# Altium schematic sheet Clock_distrubution.SchDoc: FPGA Motherboard for Digital Multiplexed Readout, McGill U.
size A; DocumentNumber: DfMUX14; Revision: Rev0, Prototype; SheetNumber: 14; SheetTotal: 27; PageSetup: Record=PageOptions|CenterHorizontal=True|CenterVertical=True|PrintScale=1.05|XCorrection=1.00|YCorrection=1.00|PrintKind=0|BorderSize=5000000|LeftOffset=0|BottomOffset=0|Orientation=2|PaperLength=1000|PaperWidth=1000|Scale=100|PaperSource=7|PrintQuality=-4|MediaType=1|DitherType=10|PaperKind=Letter|PrintScaleMode=1
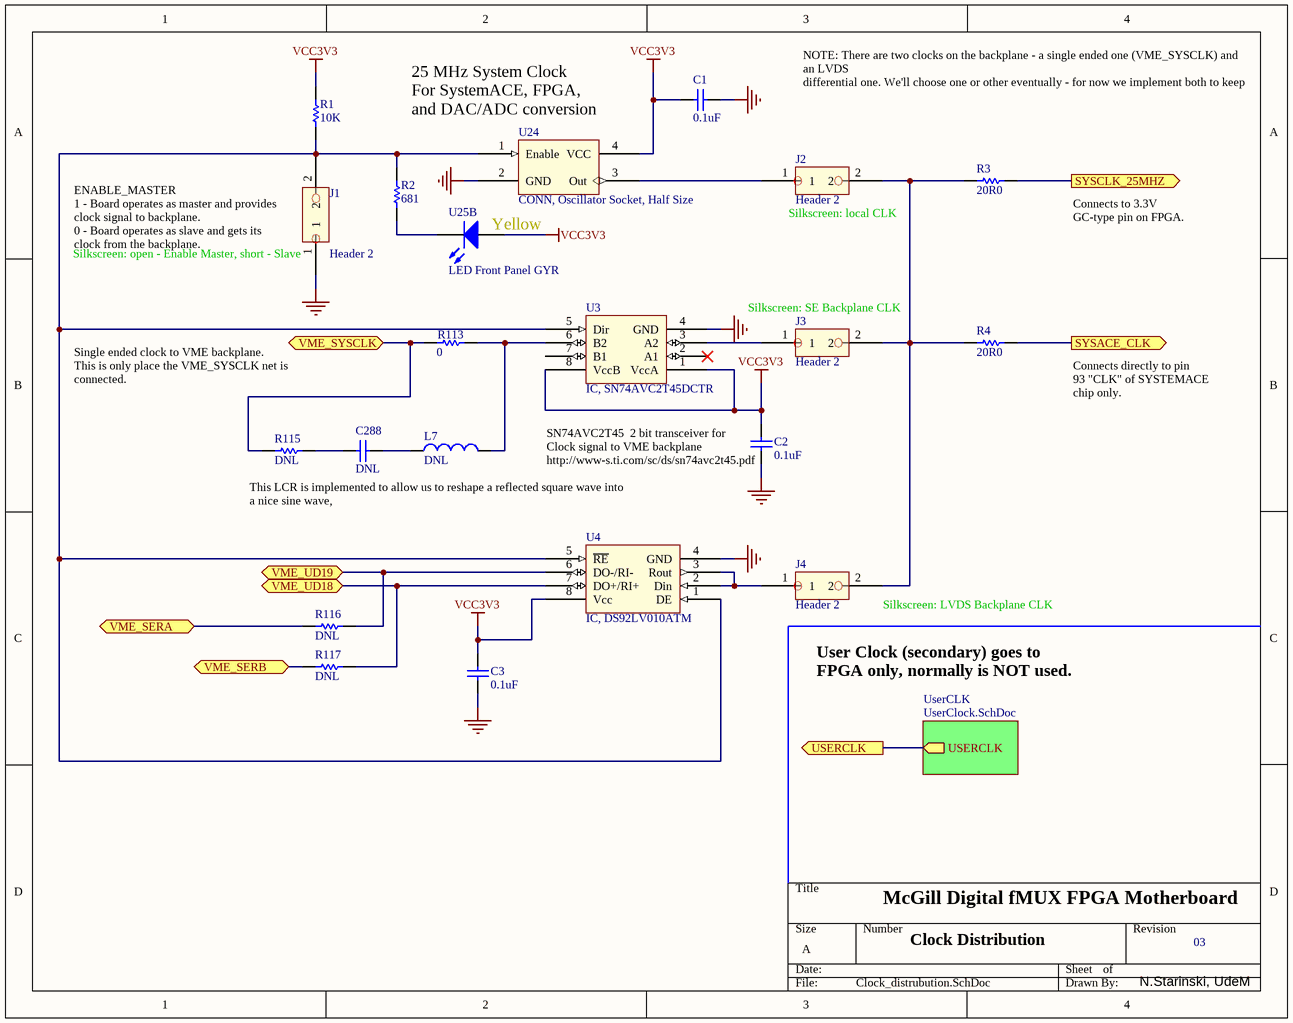
[diagram p0: Clock_distrubution.SchDoc]

## Parts
C1  0.1uF  [CC1608-0603]
C2  0.1uF  [CC1608-0603]
C3  0.1uF  [CC1608-0603]
C288  DNL  [CC1608-0603]
J1  Header 2  [HDR1X2]
J2  Header 2  [HDR1X2]
J3  Header 2  [HDR1X2]
J4  Header 2  [HDR1X2]
L7  DNL  [INDC2012-0805]
R1  10K  [CR1608-0603]
R2  681  [CR1608-0603]
R3  20R0  [CR1608-0603]
R4  20R0  [CR1608-0603]
R113  0  [CR1608-0603]
R115  DNL  [CR1608-0603]
R116  DNL  [CR1608-0603]
R117  DNL  [CR1608-0603]
U3  IC, SN74AVC2T45DCTR  [TSSO3x5-G8/X.35]
U4  IC, DS92LV010ATM  [SOP8]
U24  CONN, Oscillator Socket, Half Size  [DIP_Osc]
U25  LED Front Panel GYR  [LED_Tri_]  (part B of 3)

## Sub-sheets
UserCLK = UserClock.SchDoc: USERCLK (out)

## Ports
SYSACE_CLK (out), SYSCLK_25MHZ (out), USERCLK (out), VME_SERA (bidir), VME_SERB (bidir), VME_SYSCLK (bidir), VME_UD18 (bidir), VME_UD19 (bidir)

## Nets
GND: C1.2 C2.1 C3.1 J1.1 U3.4(GND) U4.4(GND) U24.2(GND)
VCC3V3: C1.1 C2.2 C3.2 R1.2 U3.1(VccA) U3.8(VccB) U4.8(Vcc) U24.4(VCC) U25.A2(A)
SYSACE_CLK: R4.2 ; port SYSACE_CLK
SYSCLK_25MHZ: R3.2 ; port SYSCLK_25MHZ
USERCLK: port USERCLK, sheet UserCLK/USERCLK
VME_SERA: R116.1 ; port VME_SERA
VME_SERB: R117.1 ; port VME_SERB
VME_SYSCLK: R113.1 R115.1 ; port VME_SYSCLK
VME_UD18: R117.2 U4.7(DO+/RI+) ; port VME_UD18
VME_UD19: R116.2 U4.6(DO-/RI-) ; port VME_UD19
NetC288_1: C288.1 R115.2
NetC288_2: C288.2 L7.1
NetJ1_2: J1.2 R1.1 R2.2 U3.5(Dir) U4.1(DE) U4.5(~{RE}) U24.1(Enable)
NetJ2_1: J2.1 U24.3(Out)
NetJ2_2: J2.2 J3.2 J4.2 R3.1 R4.1
NetJ3_1: J3.1 U3.3(A2)
NetJ4_1: J4.1 U4.2(Din) U4.3(Rout)
NetL7_2: L7.2 R113.2 U3.6(B2)
NetR2_1: R2.1 U25.K2(K)

Not connected (* = marked no-connect by the designer): U3 2(A1)* 7(B1)

## Notes on the sheet
- NOTE: There are two clocks on the backplane - a single ended one (VME_SYSCLK) and an LVDS
  differential one. We'll choose one or other eventually - for now we implement both to keep our options open.
- (near U24) 25 MHz System Clock
  For SystemACE, FPGA,
  and DAC/ADC conversion
- (near U25) Yellow
- (near J2) Silkscreen: local CLK
- Connects to 3.3V
  GC-type pin on FPGA.
- (near J1) ENABLE_MASTER
  1 - Board operates as master and provides clock signal to backplane.
  0 - Board operates as slave and gets its clock from the backplane.
- (near J1) Silkscreen: open - Enable Master, short - Slave
- (near J3) Silkscreen: SE Backplane CLK
- Single ended clock to VME backplane.
  This is only place the VME_SYSCLK net is connected.
- Connects directly to pin
  93 "CLK" of SYSTEMACE
  chip only.
- This LCR is implemented to allow us to reshape a reflected square wave into a nice sine wave,
  as suggested by JP Martin.
- (near C2) SN74AVC2T45  2 bit transceiver for Clock signal to VME backplane
  http://www-s.ti.com/sc/ds/sn74avc2t45.pdf
- (near J4) Silkscreen: LVDS Backplane CLK
- User Clock (secondary) goes to
  FPGA only, normally is NOT used.
- McGill Digital fMUX FPGA Motherboard
- Clock Distribution
- 03
- N.Starinski, UdeM

## Library data of the parts
C1-C3 C288 = Cap Semi: Capacitor (Semiconductor SIM Model); Published: 8-Jun-2000; LatestRevisionDate: 17-Jul-2002; LatestRevisionNote: Re-released for DXP Platform.; PackageReference: C1206; Publisher: Altium Limited
J1-J4 = Jumper_100mil: Header, 0.1" 2-Pin straight
L7 = Inductor: Code_IEC: 1005; Published: 8-Jun-2000; LatestRevisionDate: 17-Jul-2002; LatestRevisionNote: Re-released for DXP Platform.; PackageReference: 0402-A; Publisher: Altium Limited; Code_JEITA: 0402
R1-R4 R113 = Res Semi: Resistor 0603; Published: 8-Jun-2000; LatestRevisionDate: 17-Jul-2002; LatestRevisionNote: Re-released for DXP Platform.; Publisher: Altium Limited
R115-R117 = Res Semi: Semiconductor Resistor; Published: 8-Jun-2000; LatestRevisionDate: 17-Jul-2002; LatestRevisionNote: Re-released for DXP Platform.; Publisher: Altium Limited
U3 = SN74AVC2T45: Dual-bit Dual-supply Bus Transceiver
U4 = DS92LV010A: Bus LVDS 3.3/5.0V Single Transceiver
U24 = Osc_Socket: 1108800 ARIES Oscillator Socket
U25 = LED_Tri: 564-0200-132F